# EAGLE design drone5 (EAGLE 9.6.2)
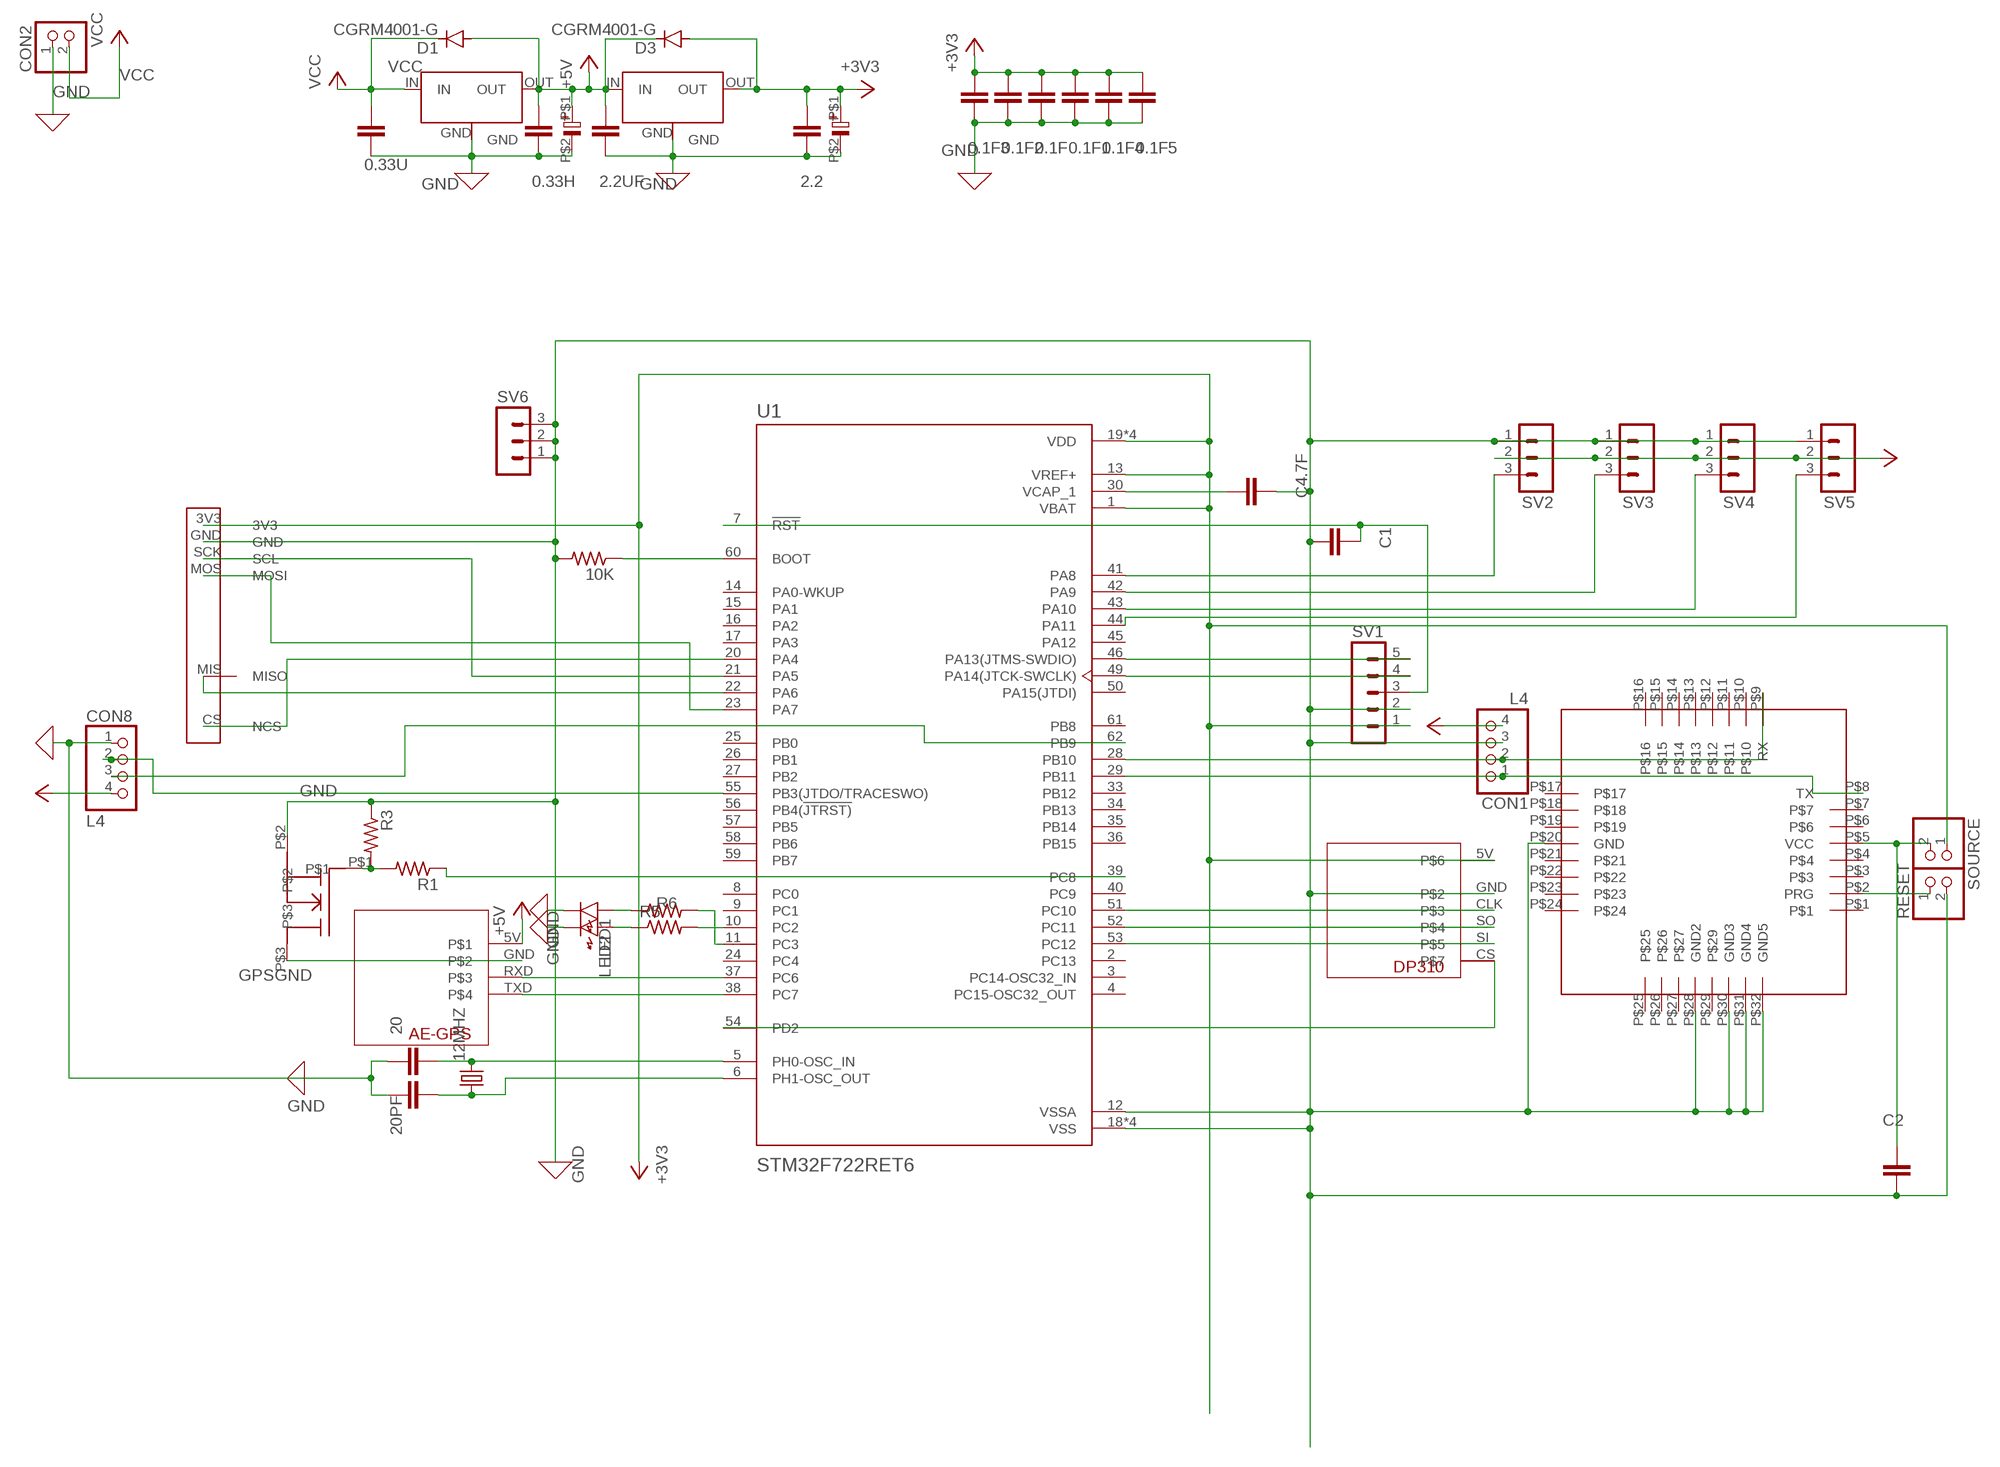
[diagram p0: schematic, sheet 1]

## Parts
0.1F  C-EUC0603  [C0603]
0.1F1  C-EUC0603  [C0603]
0.1F2  C-EUC0603  [C0603]
0.1F3  C-EUC0603  [C0603]
0.1F4  C-EUC0603  [C0603]
0.1F5  C-EUC0603  [C0603]
0.33H  C-EUC0603  [C0603]
0.33U  C-EUC0603  [C0603]
2.2  C-EUC0603  [C0603]
2.2UF  C-EUC0603  [C0603]
10K  R-US_R0603  [R0603]
12MHZ  CRYSTALHC49S  [HC49/S]
20  C-EUC0603  [C0603]
20PF  C-EUC0603  [C0603]
47  UCD0J470MCL1GS  [UCD0J470MCL1GS]
47U  UCD0J470MCL1GS  [UCD0J470MCL1GS]
C1  C-EUC0603  [C0603]
C2  C-EUC0603  [C0603]
C4.7F  C-EUC0603  [C0603]
CON1  L4  [L_4]
CON2  L2  [L_2]
CON8  L4  [L_4]
CS1  DP310DP310  [AE-GPS-HOLE]
D1  CGRM4001-G  [SOD-123_MINI-SMA]
D3  CGRM4001-G  [SOD-123_MINI-SMA]
LED1  LED1608  [LED1608]
LED2  LED1608  [LED1608]
R1  R-US_R0603  [R0603]
R3  R-US_R0603  [R0603]
R5  R-US_R0603  [R0603]
R6  R-US_R0603  [R0603]
RESET  PINHD-1X2  [1X02]
SOURCE  PINHD-1X2  [1X02]
SV1  MA05-1  [MA05-1]
SV2  MA03-1  [MA03-1]
SV3  MA03-1  [MA03-1]
SV4  MA03-1  [MA03-1]
SV5  MA03-1  [MA03-1]
SV6  MA03-1  [MA03-1]
U1  STM32F722RET6  [QFP50P1200X1200X160-64N]
U$1  LITE  [LITE]
U$2  MPU9250  [MPU9250]
U$3  AE-GPS-HOLE  [AE-GPS-HOLE]
U$4  NJM2391DL1-33  [NJM2391DL1-33]
U$7  SSM3K329R  [SSM3K329R]
U$9  NJM2391DL1-33  [NJM2391DL1-33]

## Nets
+3V3 [New Class]: 0.1F1.1 0.1F2.1 0.1F3.1 0.1F4.1 0.1F5.1 0.1F.1 2.2.1 47.P$1(+) CS1.5V D3.A SOURCE.1 SV1.1 U1.1(VBAT) U1.13(VREF+) U1.19(VDD) U1.32(VDD) U1.48(VDD) U1.64(VDD) U$2.3V3 U$4.OUT
+5V [New Class]: 0.33H.1 2.2UF.1 47U.P$1(+) CON1.4 CON8.4 D1.A D3.C SV2.2 SV3.2 SV4.2 SV5.2 U$3.5V U$4.IN U$9.OUT
CLK3: CS1.CLK U1.51(PC10)
GND: 0.1F1.2 0.1F2.2 0.1F3.2 0.1F4.2 0.1F5.2 0.1F.2 0.33H.2 0.33U.2 2.2.2 2.2UF.2 10K.2 20.1 20PF.1 47.P$2(ー) 47U.P$2(ー) C1.1 C2.1 C4.7F.2 CON1.3 CON2.1(GND) CON8.1 CS1.GND LED1.K LED2.K R3.1 RESET.2 SV1.2 SV2.1 SV3.1 SV4.1 SV5.1 SV6.1 SV6.2 SV6.3 U1.12(VSSA) U1.18(VSS) U1.31(VSS) U1.47(VSS) U1.63(VSS) U$1.P$20(GND) U$1.P$28(GND2) U$1.P$30(GND3) U$1.P$31(GND4) U$1.P$32(GND5) U$2.GND U$4.GND U$7.P$2 U$9.GND
GPSGND: U$3.GND U$7.P$3
MISO3: CS1.SO U1.52(PC11)
MOSI3: CS1.SI U1.53(PC12)
N$1: 10K.1 U1.60(BOOT)
N$2: U1.21(PA5) U$2.SCK(SCL)
N$3: LED2.A R5.1
N$4: C4.7F.1 U1.30(VCAP_1)
N$5: SV1.5 U1.46(PA13(JTMS-SWDIO))
N$6: SV1.4 U1.49(PA14(JTCK-SWCLK))
N$7: CON1.1 U1.29(PB11) U$1.P$8(TX)
N$8: CS1.CS U1.54(PD2)
N$9: CON1.2 U1.28(PB10) U$1.P$9(RX)
N$10: C2.2 SOURCE.2 U$1.P$5(VCC)
N$11: RESET.1 U$1.P$2(PRG)
N$12: U1.22(PA6) U$2.MIS(MISO)
N$13: SV2.3 U1.41(PA8)
N$14: SV3.3 U1.42(PA9)
N$15: SV4.3 U1.43(PA10)
N$16: SV5.3 U1.44(PA11)
N$17: R6.2 U1.11(PC3)
N$18: LED1.A R6.1
N$19: 12MHZ.1 20PF.2 U1.6(PH1-OSC_OUT)
N$20: CON8.2 U1.55(PB3(JTDO/TRACESWO))
N$21: CON8.3 U1.62(PB9)
N$23: U1.23(PA7) U$2.MOS(MOSI)
N$24: U1.20(PA4) U$2.CS(NCS)
N$28: R5.2 U1.10(PC2)
N$29: R1.1 U1.39(PC8)
N$33: R1.2 R3.2 U$7.P$1
NRST: C1.2 SV1.3 U1.7(!RST)
PH0_OSC_IN: 12MHZ.2 20.2 U1.5(PH0-OSC_IN)
UART6RX: U1.38(PC7) U$3.TXD
UART6TX: U1.37(PC6) U$3.RXD
VCC: 0.33U.1 CON2.2 D1.C U$9.IN
Unconnected: U1.2(PC13) U1.3(PC14-OSC32_IN) U1.4(PC15-OSC32_OUT) U1.8(PC0) U1.9(PC1) U1.14(PA0-WKUP) U1.15(PA1) U1.16(PA2) U1.17(PA3) U1.24(PC4) U1.25(PB0) U1.26(PB1) U1.27(PB2) U1.33(PB12) U1.34(PB13) U1.35(PB14) U1.36(PB15) U1.40(PC9) U1.45(PA12) U1.50(PA15(JTDI)) U1.56(PB4(!JTRST)) U1.57(PB5) U1.58(PB6) U1.59(PB7) U1.61(PB8) U$1.P$1 U$1.P$3 U$1.P$4 U$1.P$6 U$1.P$7 U$1.P$10 U$1.P$11 U$1.P$12 U$1.P$13 U$1.P$14 U$1.P$15 U$1.P$16 U$1.P$17 U$1.P$18 U$1.P$19 U$1.P$21 U$1.P$22 U$1.P$23 U$1.P$24 U$1.P$25 U$1.P$26 U$1.P$27 U$1.P$29

## Library data of the parts
0.1F 0.1F1-0.1F5 0.33H 0.33U 2.2 2.2UF 20 20PF C1 C2 C4.7F = rcl:C-EU: CAPACITOR, European symbol; SPICEPREFIX: C
10K R1 R3 R5 R6 = rcl:R-US_: RESISTOR, American symbol; SPICEPREFIX: R
12MHZ = crystal:CRYSTAL: CRYSTAL; OC_FARNELL: 1667008; OC_NEWARK: unknown; SPICEPREFIX: B
47 47U = chip-capacitor:UCD0J470MCL1GS
CON1 CON8 = CREATE_sensor_dip:L4
CON2 = CREATE_sensor_dip:L2
CS1 = DP310:DP310
D1 D3 = diode:CGRM400*-G: Molded plasitc,JEDEC SOD-123/Mini SMA Source: Comchip CGRM4001-G.pdf
LED1 LED2 = generic:LED: Generic LEDs
RESET SOURCE = pinhead:PINHD-1X2: PIN HEADER
SV1 = con-lstb:MA05-1: PIN HEADER; OC_FARNELL: unknown; OC_NEWARK: unknown
SV2-SV6 = con-lstb:MA03-1: PIN HEADER; OC_FARNELL: unknown; OC_NEWARK: unknown
U1 = STM32F722RET6:STM32F722RET6: STM32F Series 512 KB Flash 256 kB RAM 216 MHz 32-Bit Microcontroller - LQFP-64 Check availability <https://pricing.snapeda.com/parts/STM32F722RET6/STMicroelectronics/view-part?ref=eda>; AVAILABILITY: In Stock; DESCRIPTION: ARM® Cortex®-M7 STM32F7 Microcontroller IC 32-Bit Single-Core 216MHz 512KB (512K x 8) FLASH 64-LQFP (10x10); MF: STMicroelectronics; MP: STM32F722RET6; PACKAGE: LQFP-64 STMicroelectronics; PRICE: None; PURCHASE-URL: https://pricing.snapeda.com/search/part/STM32F722RET6/?ref=eda
U$1 = TWELite:LITE
U$2 = mpu9250:MPU9250
U$3 = AE-GPS-HOLE:AE-GPS-HOLE
U$4 U$9 = CREATE_sensor_dip:NJM2391DL1-33
U$7 = SSM3K329R:SSM3K329R

## Board
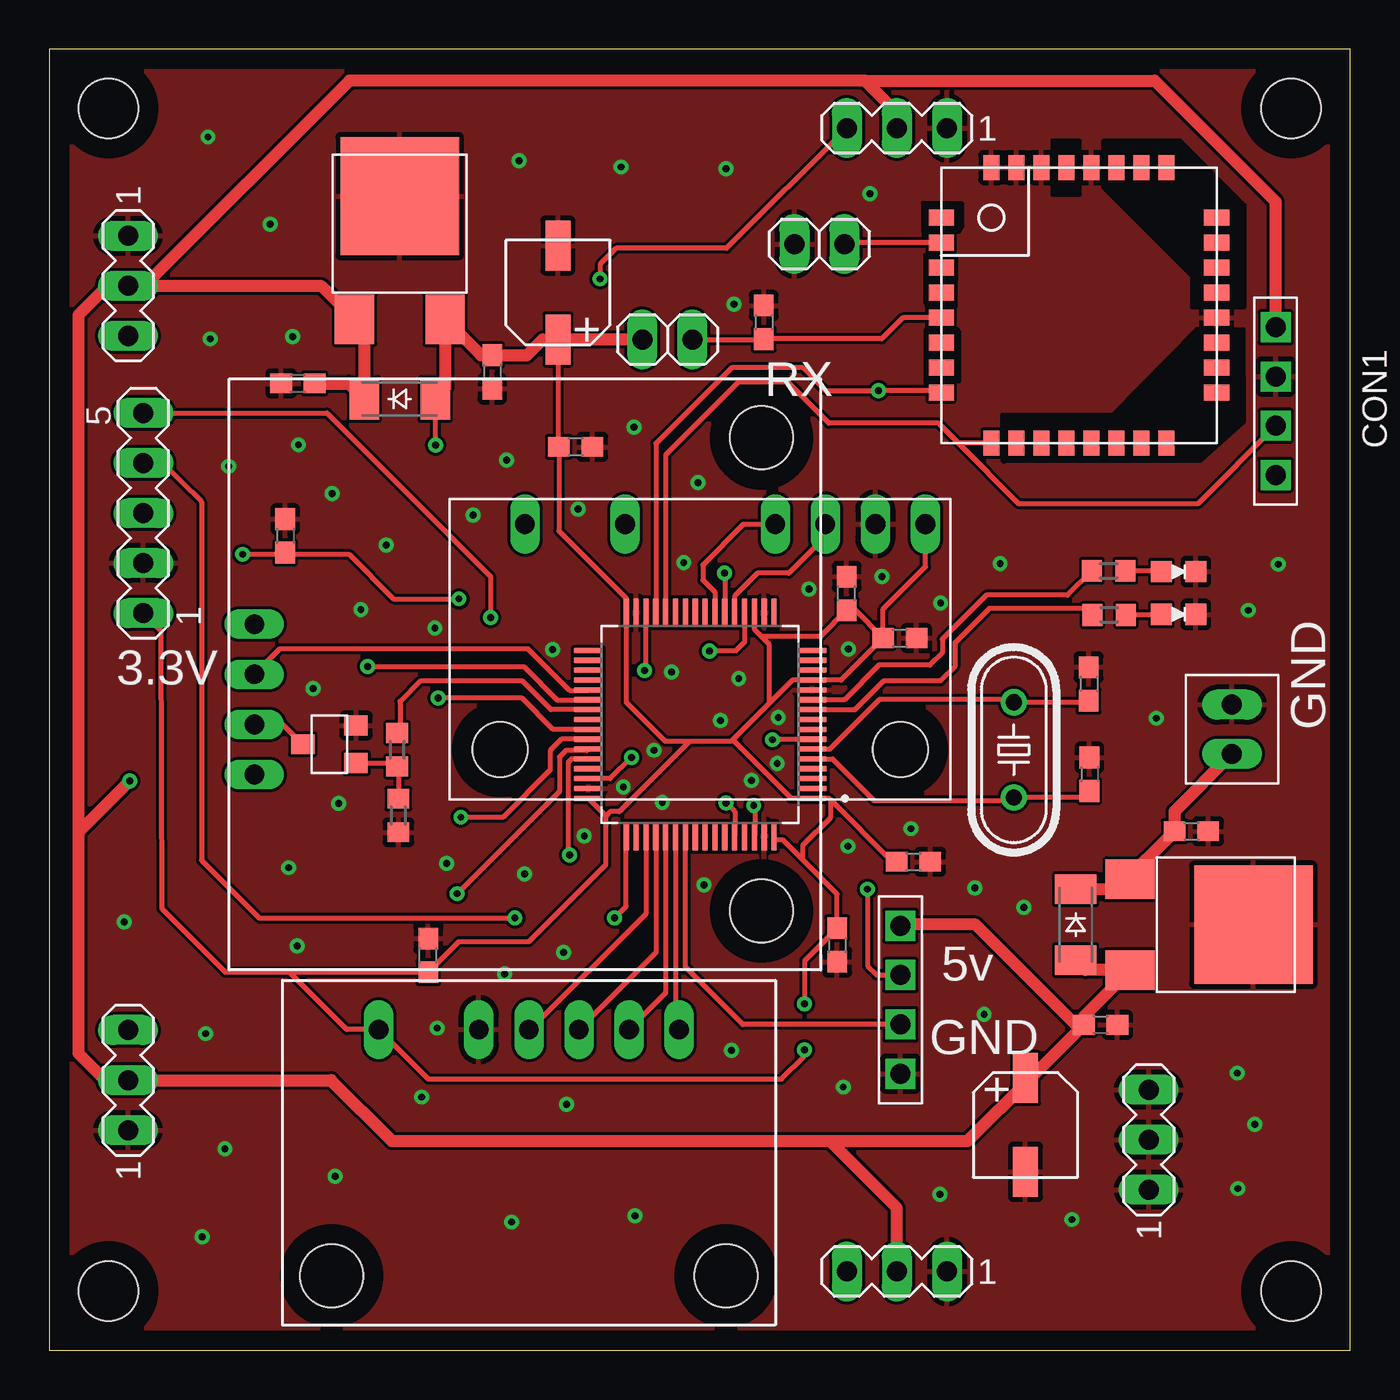
[diagram p1: board, top side]
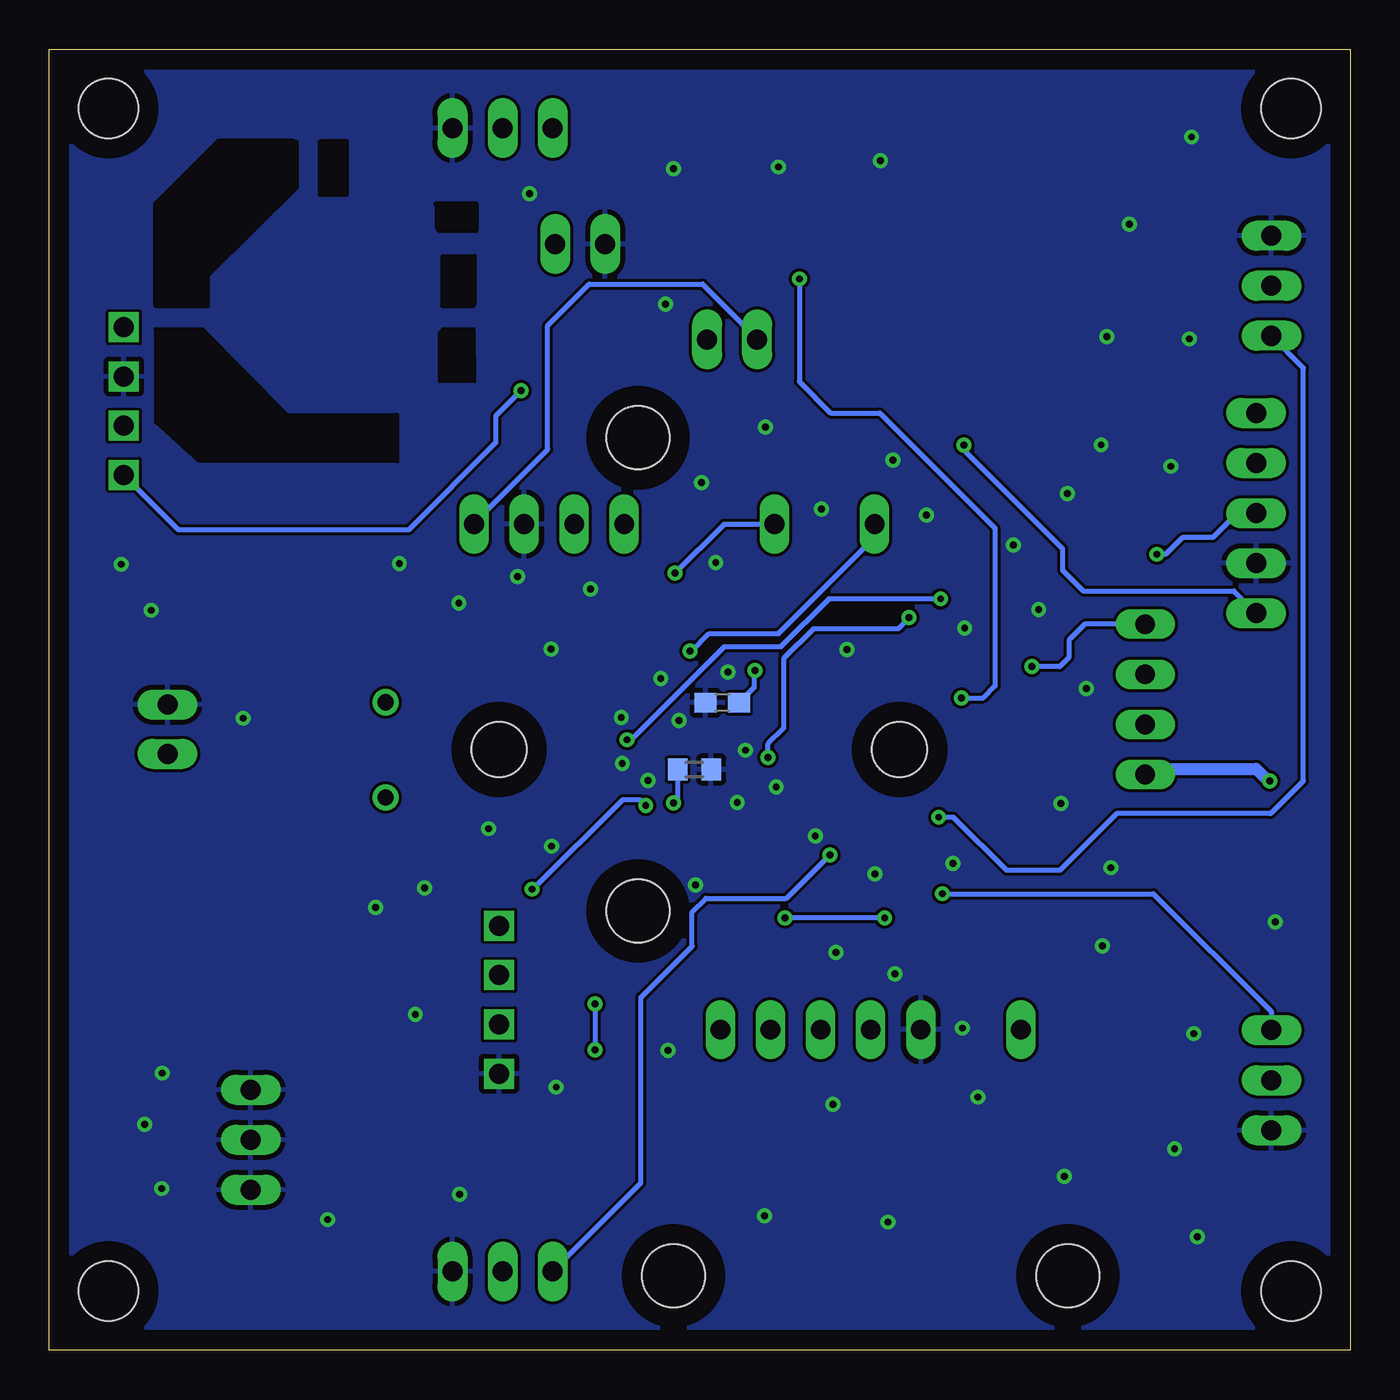
[diagram p2: board, bottom side, seen from below]

Size 66 x 66 mm. Coordinates in mm from the lower left corner, seen from the top.
Outline: 0,0 66,0 66,66 0,66 0,0
Copper layers (1*16): Top 0.035mm / dielectric 1.5mm / Bottom 0.035mm
Design rules "default": minimum track width 6mil, minimum drill 0.35mm, track to track 6mil, track to pad 6mil, pad to pad 6mil, via to via 6mil, smd to smd 6mil, copper to edge 40mil, drill to drill 6mil, minimum pad ring 10mil, minimum via ring 8mil, stop-mask expansion 4mil, vias tented up to drill 0mil, thermal gap 10mil
Holes 3 mm at 3,3 63,3 63,63 3,63
tRestrict: 43 lines
bRestrict: 46 lines

### Footprints (pad centres in the part's own frame; a part is rotated, then mirrored left to right if it is on the bottom)
C0603 = smd 1.1 x 1: 1 -0.85,0; 2 0.85,0
R0603 = smd 1 x 1.1: 1 -0.85,0; 2 0.85,0
HC49/S = drill 0.813: 1 -2.413,0; 2 2.413,0
UCD0J470MCL1GS = smd 1.27 x 2.54: P$1 0,2.38; P$2 0,-2.38
L_4 = drill 1.016 square: 1 3.75,0; 2 1.25,0; 3 -1.25,0; 4 -3.75,0
L_2 = drill 1.016 long: 1 1.25,0; 2 -1.25,0
AE-GPS-HOLE = drill 1 long: 5V -7.38,20.12; CLK -7.38,12.5; CS -7.38,4.88; GND -7.38,15.04; SI -7.38,7.42; SO -7.38,9.96 | hole 3.2: 5.12,22.5; 5.12,2.5
SOD-123_MINI-SMA = smd 1.5 x 2.1: A 1.8,0; C -1.8,0
LED1608 = smd 1.05 x 1.08: A -0.875,0; K 0.875,0
1X02 = drill 1.016 long: 1 -1.27,0; 2 1.27,0
MA05-1 = drill 1.016 long: 1 -5.08,0; 2 -2.54,0; 3 0,0; 4 2.54,0; 5 5.08,0
MA03-1 = drill 1.016 long: 1 -2.54,0; 2 0,0; 3 2.54,0
QFP50P1200X1200X160-64N = smd 1.47 x 0.28: 1 -5.67,3.75; 2 -5.67,3.25; 3 -5.67,2.75; 4 -5.67,2.25; 5 -5.67,1.75; 6 -5.67,1.25; 7 -5.67,0.75; 8 -5.67,0.25; 9 -5.67,-0.25; 10 -5.67,-0.75; 11 -5.67,-1.25; 12 -5.67,-1.75; 13 -5.67,-2.25; 14 -5.67,-2.75; 15 -5.67,-3.25; 16 -5.67,-3.75; 33 5.67,-3.75; 34 5.67,-3.25; 35 5.67,-2.75; 36 5.67,-2.25; 37 5.67,-1.75; 38 5.67,-1.25; 39 5.67,-0.75; 40 5.67,-0.25; 41 5.67,0.25; 42 5.67,0.75; 43 5.67,1.25; 44 5.67,1.75; 45 5.67,2.25; 46 5.67,2.75; 47 5.67,3.25; 48 5.67,3.75 | smd 0.28 x 1.47: 17 -3.75,-5.67; 18 -3.25,-5.67; 19 -2.75,-5.67; 20 -2.25,-5.67; 21 -1.75,-5.67; 22 -1.25,-5.67; 23 -0.75,-5.67; 24 -0.25,-5.67; 25 0.25,-5.67; 26 0.75,-5.67; 27 1.25,-5.67; 28 1.75,-5.67; 29 2.25,-5.67; 30 2.75,-5.67; 31 3.25,-5.67; 32 3.75,-5.67; 49 3.75,5.67; 50 3.25,5.67; 51 2.75,5.67; 52 2.25,5.67; 53 1.75,5.67; 54 1.25,5.67; 55 0.75,5.67; 56 0.25,5.67; 57 -0.25,5.67; 58 -0.75,5.67; 59 -1.25,5.67; 60 -1.75,5.67; 61 -2.25,5.67; 62 -2.75,5.67; 63 -3.25,5.67; 64 -3.75,5.67
LITE = smd 1.27 x 0.813: P$1 0,11.43; P$2 0,10.16; P$3 0,8.89; P$4 0,7.62; P$5 0,6.35; P$6 0,5.08; P$7 0,3.81; P$8 0,2.54; P$17 13.97,2.54; P$18 13.97,3.81; P$19 13.97,5.08; P$20 13.97,6.35; P$21 13.97,7.62; P$22 13.97,8.89; P$23 13.97,10.16; P$24 13.97,11.43 | smd 0.813 x 1.27: P$9 2.54,0; P$10 3.81,0; P$11 5.08,0; P$12 6.35,0; P$13 7.62,0; P$14 8.89,0; P$15 10.16,0; P$16 11.43,0; P$25 11.43,13.97; P$26 10.16,13.97; P$27 8.89,13.97; P$28 7.62,13.97; P$29 6.35,13.97; P$30 5.08,13.97; P$31 3.81,13.97; P$32 2.54,13.97
MPU9250 = drill 1 long: 3V3 0,11.43; CS 0,-8.89; GND 0,8.89; MIS 0,-3.81; MOS 0,3.81; SCK 0,6.35 | hole 2.794: 11.43,10.16; 11.43,-10.16
AE-GPS-HOLE' = drill 1 long: 5V 13.73,5.08; GND 13.73,2.54; RXD 13.73,0; TXD 13.73,-2.54 | hole 3.2: -12,-12; -12,12
NJM2391DL1-33 = smd 6 x 6: GND 0,1.4 | smd 2 x 2.5: IN -2.3,-4.85; OUT 2.3,-4.85
SSM3K329R = smd 1 x 1.2: P$1 -0.95,-1.3; P$2 0.95,-1.3; P$3 0,1.4

### Placement (x,y rotation side)
0.1F  43.15,36.13 0 top
0.1F1  19.23,20.03 90 top
0.1F2  40.45,38.39 90 top
0.1F3  26.7,45.83 0 top
0.1F4  39.97,20.56 270 top
0.1F5  43.84,24.78 0 top
0.33H  12.61,49.05 180 top
0.33U  57.94,26.33 0 top
2.2  22.47,49.63 270 top
2.2UF  53.34,16.51 0 top
10K  33.27,29.46 0 bottom
12MHZ  48.93,30.46 270 top
20  52.77,29.22 270 top
20PF  52.73,33.8 270 top
47  25.8,53.66 180 top
47U  49.53,11.43 0 top
C1  11.97,41.32 270 top
C2  36.25,52.15 270 top
C4.7F  31.86,32.85 180 bottom
CON1  62.22,48.15 270 top
CON2  60,31.5 90 top
CON8  43.18,17.78 270 top
CS1  36.83,8.89 270 bottom
D1  52.07,21.59 270 top
D3  17.78,48.26 0 top
LED1  57.29,39.5 0 top
LED2  57.29,37.33 0 top
R1  17.65,30.46 270 top
R3  17.71,27.13 90 top
R5  53.77,37.3 180 top
R6  53.74,39.54 180 top
RESET  39.07,56.12 180 top
SOURCE  31.36,51.28 0 top
SV1  4.77,42.47 90 top
SV2  43,62 180 top
SV3  4,54 270 top
SV4  4,13.7 90 top
SV5  43,4 180 top
SV6  55.78,10.68 90 top
U1  33.02,31.75 180 top
U$1  45.25,46.03 0 top
U$2  33.02,41.91 270 top
U$3  AE-GPS-HOLE  [AE-GPS-HOLE']  24.13,34.29 180 top
U$4  17.78,57.15 0 top
U$7  14.26,30.74 90 top
U$9  59.69,21.59 270 top

### Tracks (layer width: path | path; a pad name or v marks a point on that pad's centre or on a via)
+3V3  (via drill 0.35)
  Top 0.254: 0.1F.1 40.17,34 U1.13 38.67,34.02 37.73,34.02 36.51,32.8 | 0.1F.1 42.3,37.6 44.45,39.75 U$2.3V3 | 36.13,36.21 39.12,36.21 0.1F2.1 40.89,37.54 0.1F.1 | 36.13,36.21 35.77,36.57 U1.19 | SV1.1 5.68,36.48 5.72,22.39 8.92,19.19 12.17,19.19 | 12.17,19.19 15.09,16.27 CS1.5V 19.22,13.76 37.15,13.76 38.31,14.92 v38.31,15.24 | 0.1F5.1 42.78,24.78 39.65,27.91 | 39.65,27.91 39.56,28 U1.1 37.62,28.01 34.68,30.95 34.66,30.95 | 34.66,30.95 34.61,30.9 32.51,30.9 | 34.66,30.95 36.51,32.8 | 36.13,36.21 36.51,35.83 36.51,32.8 | 47.P$1 25.8,45.88 0.1F3.1 25.85,41.57 29.27,38.15 U1.32 29.27,32.88 31.25,30.9 32.51,30.9 | 12.17,19.19 0.1F1.1 20.78,20.73 24.34,20.73 28.25,24.64 28.25,27.11 | U1.48 28.25,27.11 | 32.51,30.9 28.93,27.32 28.46,27.32 28.25,27.11 | D3.A v19.58,45.93 v19.59,45.92 | U1.64 36.77,25.88 37.23,25.88 38.24,24.86 | 39.65,27.91 39.65,27.04 38.24,25.64 38.24,24.86 | v38.32,17.56 38.32,19.76 0.1F4.1 39.97,23.14 38.24,24.86
  Top 0.61: D3.A 20.08,48.76 U$4.OUT 21.9,50.48 2.2.1 24.23,50.48 25.03,51.28 47.P$1 SOURCE.1
  Bottom 0.254: U$2.3V3 44.45,41.96 40.71,45.7 40.71,51.99 38.61,54.09 32.86,54.09 30.09,51.32 SOURCE.1 | v19.59,45.92 19.59,45.66 14.6,40.67 14.6,39.58 13.54,38.52 5.89,38.52 SV1.1 | v38.32,17.56 v38.32,15.25 v38.31,15.24
+5V  (via drill 0.35)
  Top 0.61: D1.A 52.57,19.29 U$9.OUT 52.49,16.94 2.2UF.1 | 2.2UF.1 49.79,13.81 | 49.79,13.81 47U.P$1 | 2.2UF.1 52.07,16.51 46.99,21.59 43.24,21.59 CON8.4 | 39.61,10.61 17.39,10.61 14.3,13.7 SV4.2 2.85,13.7 1.48,15.07 1.48,26.28 | 41.38,64.41 15.23,64.41 4.82,54 | SV2.2 43,62.79 41.38,64.41 | SV5.2 43,7.22 39.61,10.61 | 39.61,10.61 46.59,10.61 49.79,13.81 | 4.82,54 SV3.2 2.97,54 1.48,52.51 1.48,26.28 | 4.82,54 13.78,54 U$4.IN 15.98,51.8 D3.C 15.19,49.05 0.33H.1 | 1.48,26.28 v4.08,28.88 | CON1.4 62.22,58.27 56.08,64.41 41.38,64.41
  Bottom 0.61: U$3.5V 10.12,29.49 4.77,29.49 4.16,28.88 v4.08,28.88
CLK3
  Top 0.254: U1.51 30.27,22.14 24.4,16.27 CS1.CLK
GND  (via drill 0.35)
  other vias: 31.1,27.78 36.93,29.77 29.12,28.58 34.98,34.07 34.06,31.94 24.12,24.17 20.16,24.69 12.15,24.48 14.67,27.74 13.38,33.58 15.81,37.57 14.34,43.47 56.16,32.06 60.82,37.54 62.36,39.87 48.24,39.91 29,60.03 8.05,61.55 11.2,57.13 8.17,51.31 9.1,44.84 3.8,21.72 7.94,16.06 8.91,10.21 7.75,5.76 23.46,6.5 29.72,6.81 19.67,16.34 18.89,12.84 14.51,8.82 40.28,13.35 45.18,7.91 51.87,6.63 61.16,11.45 60.27,14.06 47.43,17.04 49.44,22.46 40.55,35.58 45.22,37.91 42.25,39.25 38.54,38.62 43.72,26.46 29.66,46.83 32.91,44.01 21.5,42.36 23.84,60.35 41.63,58.67 34.33,59.95 34.73,53.08 17.09,40.85 19.56,36.64 26.24,12.48 34.61,15.22 23.1,19.1 12.57,20.51 26.83,42.67 23.2,45.16 12.64,45.93 12.34,51.42 60.29,8.2 46.95,23.46 40.51,25.57 26.09,20.18 32.19,39.97 25.53,35.55 31.57,34.41 36.98,32.1 30.68,30.44 27.14,26.1 33.22,23.61 35.63,28.9
  pour Top: 0,66.52 0,0 66.53,0 66.53,66.52
  pour Bottom: -0.06,66.46 -0.06,-0.09 66.5,-0.09 66.5,66.46
GPSGND
  Top 0.254: U$7.P$3 11.85,31.75 U$3.GND
MISO3
  Top 0.254: U1.52 30.77,20.17 CS1.SO
MOSI3
  Top 0.254: U1.53 31.27,20.07 31.27,19.84 31.27,18.13 CS1.SI
N$1  (via drill 0.35)
  Top 0.254: U1.60 34.78,27.32 v34.34,27.76
  Bottom 0.254: 10K.1 34.12,27.98 v34.34,27.76
N$2
  Top 0.254: U$2.SCK 39.37,41.27 37.52,39.42 35.93,39.42 34.77,38.26 U1.21
N$3
  Top 0.254: LED2.A 56.38,37.3 R5.1
N$4  (via drill 0.35)
  Top 0.254: U1.30 30.25,37.4 30.25,34.48 v30.2,34.48
  Bottom 0.254: v30.2,34.48 30.24,34.44 30.24,33.62 C4.7F.1
N$5  (via drill 0.35)
  Top 0.254: SV1.5 14.09,47.55 22.38,39.26 v22.38,37.17 | v29.53,30.08 28.45,29 U1.46
  Bottom 0.254: v22.38,37.17 22.38,37.15 22.93,36.6 27.24,36.6 28.75,35.09 28.75,31.55 29.53,30.77 v29.53,30.08
N$6  (via drill 0.35)
  Top 0.254: SV1.4 5.7,45.03 7.73,43.05 7.73,24.85 10.65,21.93 v23.62,21.93 | v28.68,21.93 29.27,22.52 U1.49
  Bottom 0.254: v23.62,21.93 v28.68,21.93
N$7  (via drill 0.35)
  Top 0.254: U$1.P$8 44.94,48.57 | U1.29 30.78,46 34.62,49.84 38.23,49.84 39.38,48.69 v42.06,48.69 45.06,48.69 44.94,48.57 | 44.83,48.46 44.94,48.57
  Bottom 0.254: v42.06,48.69 43.35,47.4 43.35,46.04 47.77,41.62 59.44,41.62 CON1.1
N$8
  Top 0.254: U1.54 31.77,16.45 CS1.CS
N$9
  Top 0.254: U$1.P$9 46.11,46.03 | U1.28 31.27,45.42 34.95,49.1 37.48,49.1 39.55,47.03 45.11,47.03 46.11,46.03 | CON1.2 58.26,42.94 49.2,42.94 46.11,46.03
N$10
  Top 0.254: SOURCE.2 36.23,51.28 C2.2 42.24,51.31 43.31,52.38 U$1.P$5
N$11
  Top 0.254: U$1.P$2 40.41,56.19 RESET.1
N$12  (via drill 0.35)
  Top 0.254: v34.25,39.42 34.27,39.4 U1.22
  Bottom 0.254: U$2.MIS 29.21,41.89 31.78,41.89 v34.25,39.42
N$13  (via drill 0.35)
  Top 0.254: SV2.3 34.36,55.9 28.76,55.9 27.95,55.09 v27.95,54.35 | U1.41 25.56,31.5 23.98,33.08 v19.73,33.08 v19.72,33.09
  Bottom 0.254: v27.95,54.35 27.95,49.14 26.36,47.55 23.87,47.55 18.02,41.7 18.02,33.69 18.62,33.09 v19.72,33.09
N$14  (via drill 0.35)
  Top 0.254: U1.42 25.99,31 25.41,30.42 25.41,29.44 23.01,27.04 v20.88,27.04
  Bottom 0.254: v20.88,27.04 20.12,27.04 17.43,24.35 14.72,24.35 11.85,27.22 4.03,27.22 2.37,28.88 2.37,49.83 SV3.3
N$15  (via drill 0.35)
  Top 0.254: v20.69,23.16 25.88,28.35 25.88,30.1 26.2,30.42 27.27,30.42 U1.43
  Bottom 0.254: v20.69,23.16 9.98,23.16 4,17.18 SV4.3
N$16  (via drill 0.35)
  Top 0.254: U1.44 26.49,30 26.32,29.83 26.32,25.2 v26.39,25.13
  Bottom 0.254: SV5.3 35.98,8.48 35.98,17.9 33.39,20.49 33.39,22.23 32.69,22.93 28.59,22.93 v26.39,25.13
N$17
  Top 0.254: R6.2 51.66,38.31 47.54,38.31 45.3,36.07 45.3,35.37 44.68,34.75 42.08,34.75 40.33,33 U1.11
N$18
  Top 0.254: LED1.A 56.38,39.54 R6.1
N$19
  Top 0.254: 20PF.2 52.65,32.87 12MHZ.1 48.78,33.02 42.13,33.02 39.61,30.5 U1.6
N$20
  Top 0.254: CON8.2 35.19,16.53 32.27,19.45 U1.55
N$21  (via drill 0.35)
  Top 0.254: v41.51,23.39 41.51,19.5 41.98,19.03 CON8.3 | U1.62 35.8,26.11 35.8,27.64 v35.74,27.64
  Bottom 0.254: v35.74,27.64 36.04,27.94 36.9,27.94 41.45,23.39 v41.51,23.39
N$23
  Top 0.254: U$2.MOS 36.81,41.89 35.2,41.89 33.16,39.84 33.16,39.07 33.77,38.45 U1.23
N$24  (via drill 0.35)
  Top 0.254: U1.20 35.27,35.93 34.82,35.48 v33.49,35.48
  Bottom 0.254: v33.49,35.48 33.39,35.48 32.52,36.35 29,36.35 24.13,41.22 U$2.CS
N$28
  Top 0.254: R5.2 52.59,37.63 47.69,37.63 45.97,35.91 45.97,34.72 45.22,33.97 42.35,33.97 40.88,32.5 U1.10
N$29
  Top 0.254: U1.39 25.45,32.5 24,33.95 18.82,33.95 17.79,32.92 17.79,31.45 R1.1
N$33
  Top 0.254: U$7.P$1 17.47,29.79 R1.2 17.71,29.55 R3.2
NRST  (via drill 0.35)
  Top 0.254: v36.7,30.97 36.73,31 U1.7 | v20.78,38.12 17.47,38.12 15.2,40.39 11.99,40.39 11.91,40.47 C1.2 11.87,40.37 v9.82,40.37 v9.81,40.38
  Bottom 0.254: v36.7,30.97 v36.7,30.96 36.48,30.96 31.75,35.69 28.87,35.69 26.45,38.11 v20.79,38.11 v20.78,38.12 | v9.81,40.38 9.36,40.38 8.49,41.25 6.95,41.25 5.73,42.47 SV1.3
PH0_OSC_IN
  Top 0.254: U1.5 39.74,30 41.87,27.87 48.75,27.87 12MHZ.2 52.45,28.05 20.2
UART6RX  (via drill 0.35)
  Top 0.254: U1.38 25.76,33 24.08,34.68 v16.16,34.68
  Bottom 0.254: U$3.TXD 13.47,36.83 14.27,36.03 14.27,35.15 14.74,34.68 v16.16,34.68
UART6TX
  Top 0.254: U1.37 27.33,33.48 26.4,33.48 24.3,35.58 11.69,35.58 U$3.RXD
VCC
  Top 0.61: D1.C 54.34,23.39 | 54.34,23.39 U$9.IN | 54.34,23.39 54.34,23.58 0.33U.1 57.09,27.34 CON2.2

### Text on the board
tPlace: RX | 3.3V | GND | 5v | GND